# EAGLE design node (EAGLE 7.3.0)
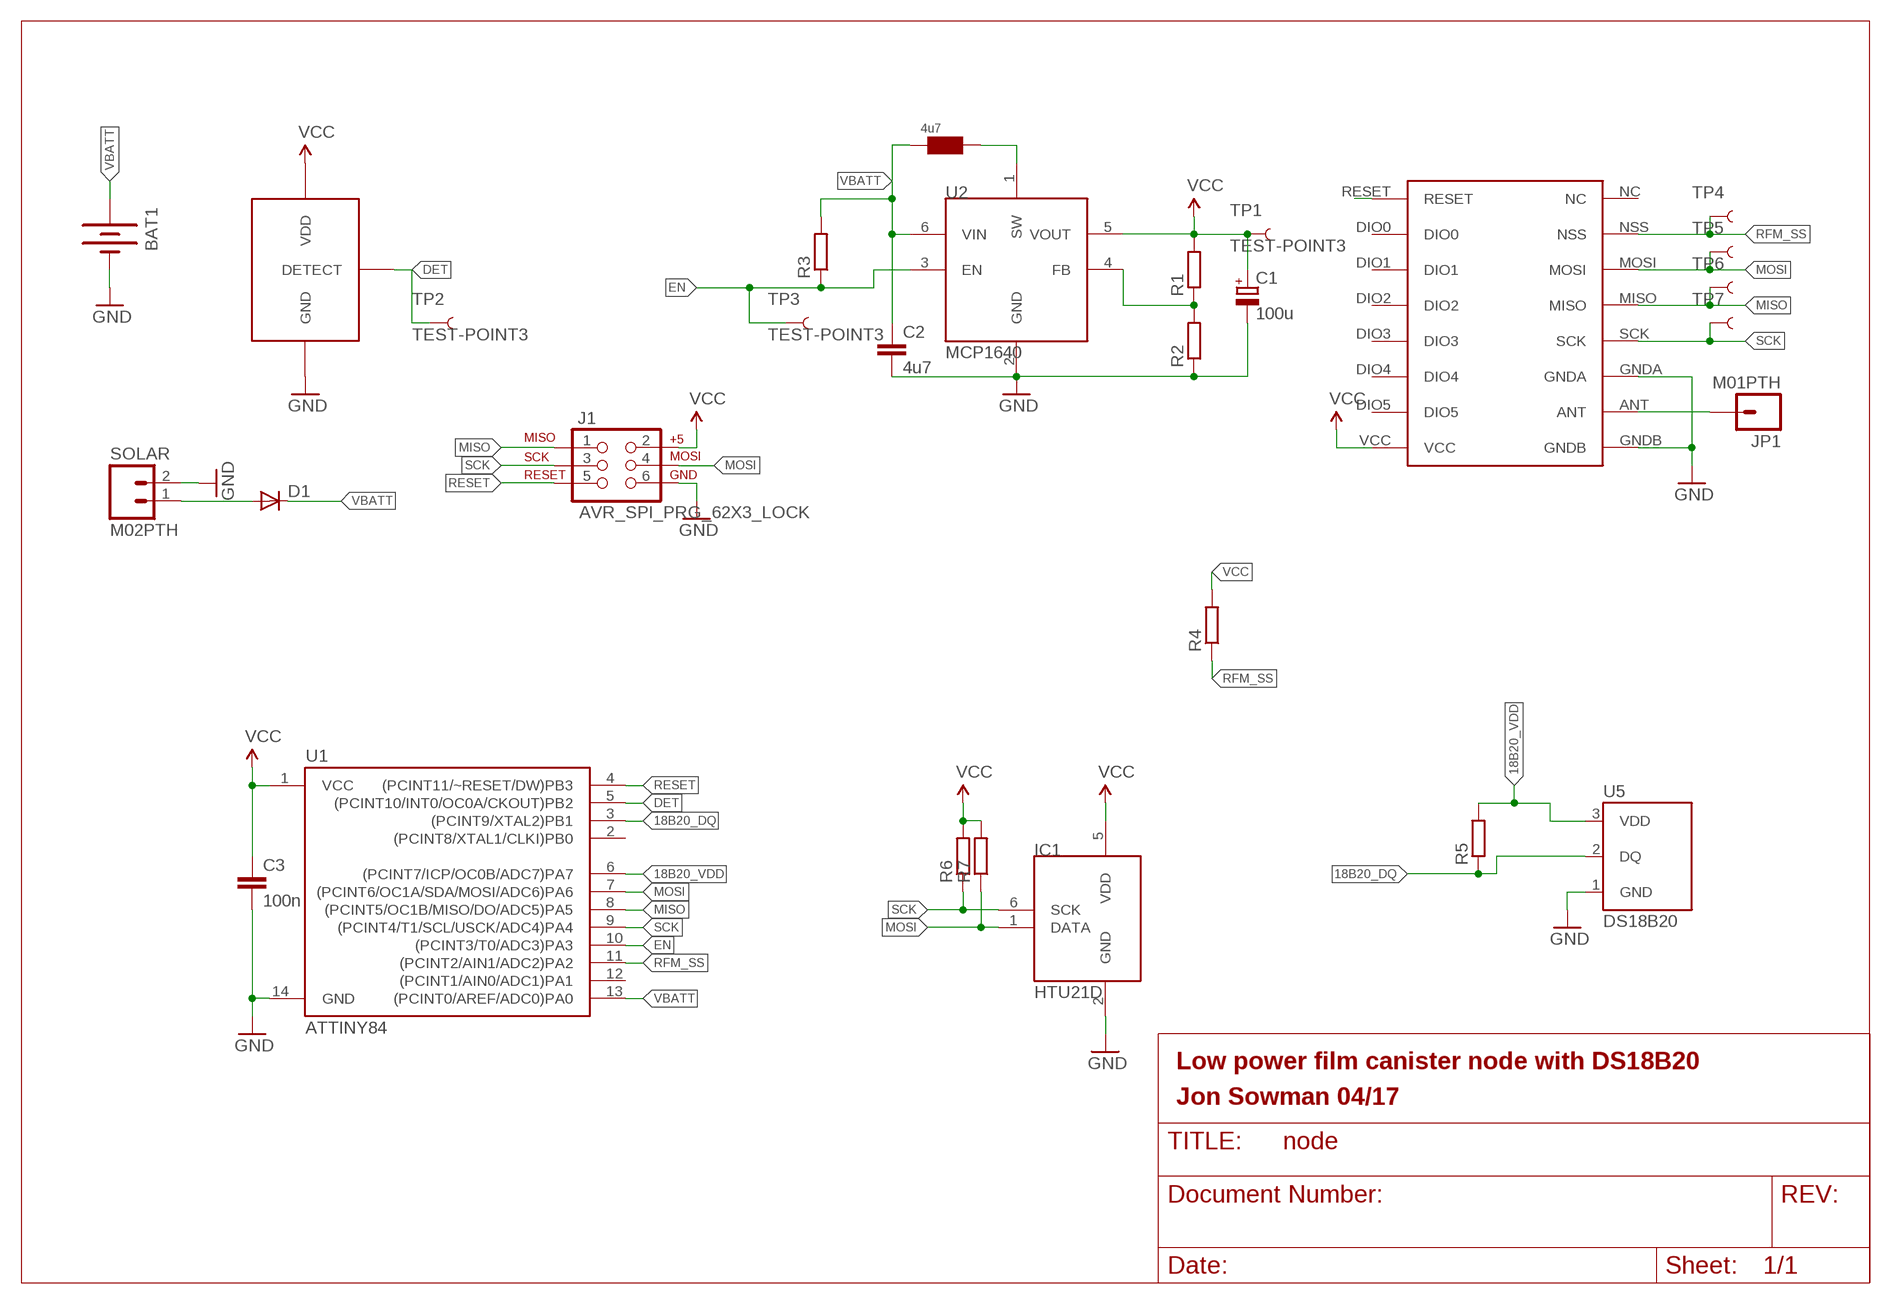
[diagram p0: schematic, sheet 1]

## Parts
BAT1  BATTERYAAA  [BATTERY-AAA]
C1  100u  CPOL-EUSANYO_SMD_C6  [SANYO-OSCON_SMD_C6]
C2  4u7  C-EUC0603  [C0603]
C3  100n  C-EUC0603  [C0603]
D1  DIODE-SOD123  [SOD123]
DF  4u7  BOURNS_SRN5040  [BOURNS_SRN5040_L]
IC1  HTU21D  [DFN6-L]
J1  AVR_SPI_PRG_62X3_LOCK  [2X3_LOCK]
JP1  M01PTH  [1X01]
R1  R-EU_R0603  [R0603]
R2  R-EU_R0603  [R0603]
R3  R-EU_R0603  [R0603]
R4  R-EU_R0603  [R0603]
R5  R-EU_R0603  [R0603]
R6  R-EU_R0603  [R0603]
R7  R-EU_R0603  [R0603]
SOLAR  M02PTH  [1X02]
TP1  TEST-POINT3  [PAD.03X.03]
TP2  TEST-POINT3  [PAD.03X.03]
TP3  TEST-POINT3  [PAD.03X.03]
TP4  TEST-POINT3  [PAD.03X.03]
TP5  TEST-POINT3  [PAD.03X.03]
TP6  TEST-POINT3  [PAD.03X.03]
TP7  TEST-POINT3  [PAD.03X.03]
U1  ATTINY84  [SO14]
U2  MCP1640  [SOT23-6]
U3  BU49X_VDET_SOT235  [SOT23-5L]
U5  DS18B20  [TO-92-AMMO]
U$4  RFM69HW  [RFM]

## Nets
18B20_DQ: R5.1 U1.3((PCINT9/XTAL2)PB1) U5.2(DQ)
18B20_VDD: R5.2 U1.6((PCINT7/ICP/OC0B/ADC7)PA7) U5.3(VDD)
DET: TP2.P$1 U1.5((PCINT10/INT0/OC0A/CKOUT)PB2) U3.1(DETECT)
EN: R3.1 TP3.P$1 U1.10((PCINT3/T0/ADC3)PA3) U2.3(EN)
GND: BAT1.GND@1(-) C1.- C2.2 C3.2 IC1.2(GND) J1.6 R2.1 SOLAR.2 U1.14(GND) U2.2(GND) U3.3(GND) U5.1(GND) U$4.GNDA U$4.GNDB
MISO: J1.1 TP6.P$1 U1.8((PCINT5/OC1B/MISO/DO/ADC5)PA5) U$4.MISO
MOSI: IC1.1(DATA) J1.4 R7.1 TP5.P$1 U1.7((PCINT6/OC1A/SDA/MOSI/ADC6)PA6) U$4.MOSI
N$1: DF.P$2 U2.1(SW)
N$2: R1.1 R2.2 U2.4(FB)
N$3: JP1.1 U$4.ANT
N$5: D1.A SOLAR.1
N$7: U$4.RESET
RESET: J1.5 U1.4((PCINT11/~RESET/DW)PB3)
RFM_SS: R4.1 TP4.P$1 U1.11((PCINT2/AIN1/ADC2)PA2) U$4.NSS
SCK: IC1.6(SCK) J1.3 R6.1 TP7.P$1 U1.9((PCINT4/T1/SCL/USCK/ADC4)PA4) U$4.SCK
VBATT: BAT1.PWR@1(+) C2.1 D1.C DF.P$1 R3.2 U1.13((PCINT0/AREF/ADC0)PA0) U2.6(VIN)
VCC: C1.+ C3.1 IC1.5(VDD) J1.2 R1.2 R4.2 R6.2 R7.2 TP1.P$1 U1.1(VCC) U2.5(VOUT) U3.2(VDD) U$4.VCC
Unconnected: U1.2((PCINT8/XTAL1/CLKI)PB0) U1.12((PCINT1/AIN0/ADC1)PA1) U$4.DIO0 U$4.DIO1 U$4.DIO2 U$4.DIO3 U$4.DIO4 U$4.DIO5 U$4.NC

## Notes on the sheet
- Low power film canister node with DS18B20
- Jon Sowman 04/17

## Library data of the parts
BAT1 = SparkFun-Electromechanical:BATTERY: Battery Holders Various common sizes : AA, AAA, 18650 (PRT-12895), 20mm coin cell and 12mm coin cell. 20MM_4LEGS, BATT-10373; PROD_ID: BATT-08571
C1 = rcl:CPOL-EU: POLARIZED CAPACITOR, European symbol
C2 C3 = rcl:C-EU: CAPACITOR, European symbol
D1 = dtb:DIODE-: DIODE
DF = jonsowman:BOURNS_SRN5040
IC1 = Mine:HTU21D
J1 = SparkFun-Connectors:AVR_SPI_PRG_6: AVR ISP 6 Pin This is the reduced ISP connector for AVR programming. Common on Arduino. This footprint will take up less PCB space and can be used with a 10-pin to 6-pin adapter such as SKU: BOB-08508 **Special note about "TEST_POINT" package. The stop mask is on the top side, so if you want your programming test points to be on the bottom of your board, make sure to place this package on the bottom side of the board. This also ensure that the orientation to program from the bottom side will be correct.
JP1 = SparkFun-Connectors:M01: Header 1 Standard 1-pin 0.1" header. Use with straight break away headers (SKU : PRT-00116), right angle break away headers (PRT-00553), swiss pins (PRT-00743), machine pins (PRT-00117), and female headers (PRT-00115).
R1-R7 = rcl:R-EU_: RESISTOR, European symbol
SOLAR = SparkFun-Connectors:M02: Standard 2-pin 0.1" header. Use with - straight break away headers ( PRT-00116) - right angle break away headers (PRT-00553) - swiss pins (PRT-00743) - machine pins (PRT-00117) - female headers (PRT-00115) Molex polarized connector foot print use with: PRT-08233 with associated crimp pins and housings. 2.54_SCREWTERM for use with PRT-10571. 3.5mm Screw Terminal footprints for PRT-08084 5mm Screw Terminal footprints for use with PRT-08432
TP1-TP7 = SparkFun-Passives:TEST-POINT: Bare copper test points for troubleshooting or ICT
U1 = SparkFun-DigitalIC:ATTINY84: Atmel 14-pin 2/4/8kB flash uC; PROD_ID: IC-11285
U2 = ukhas:MCP1640
U3 = jonsowman:BU49X_VDET_SOT235
U5 = SparkFun-Sensors:DS18B20: Dallas/Maxim DS18B20 1-wire temperature sensor Datasheet: http://datasheets.maximintegrated.com/en/ds/DS18B20.pdf temp thermometer 1-wire one-wire one wire; STORE_ID: SEN-00245
U$4 = hoperf:RFM69HW

## Board
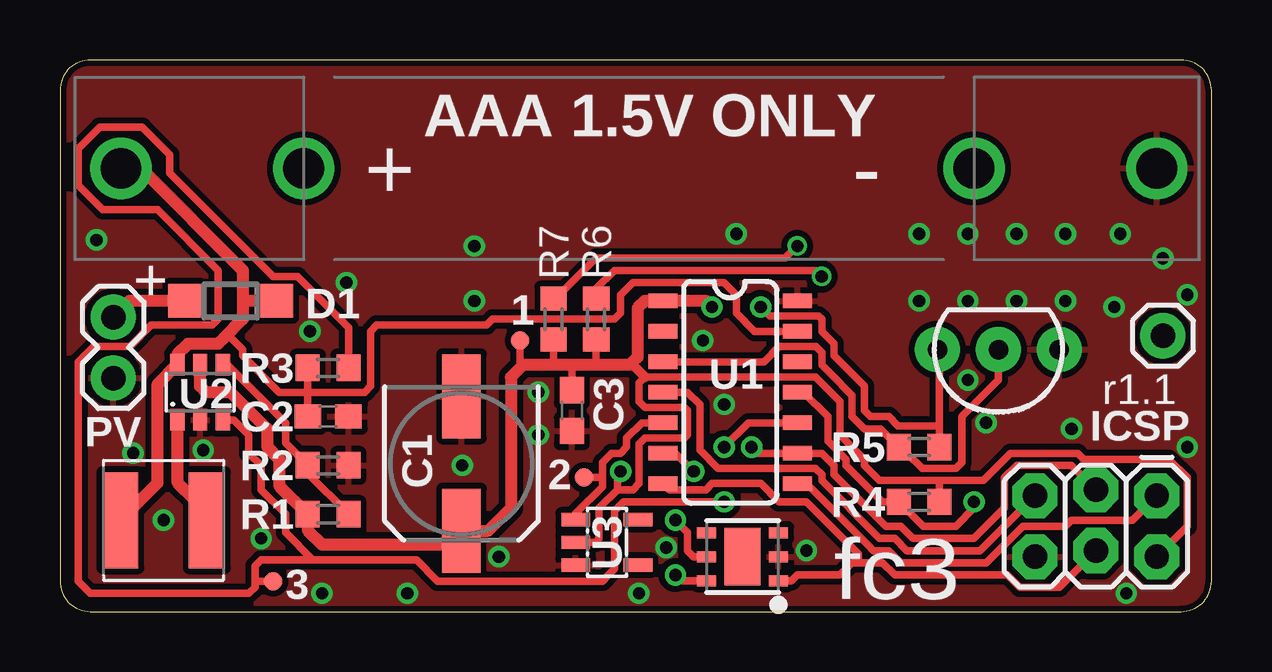
[diagram p1: board, top side]
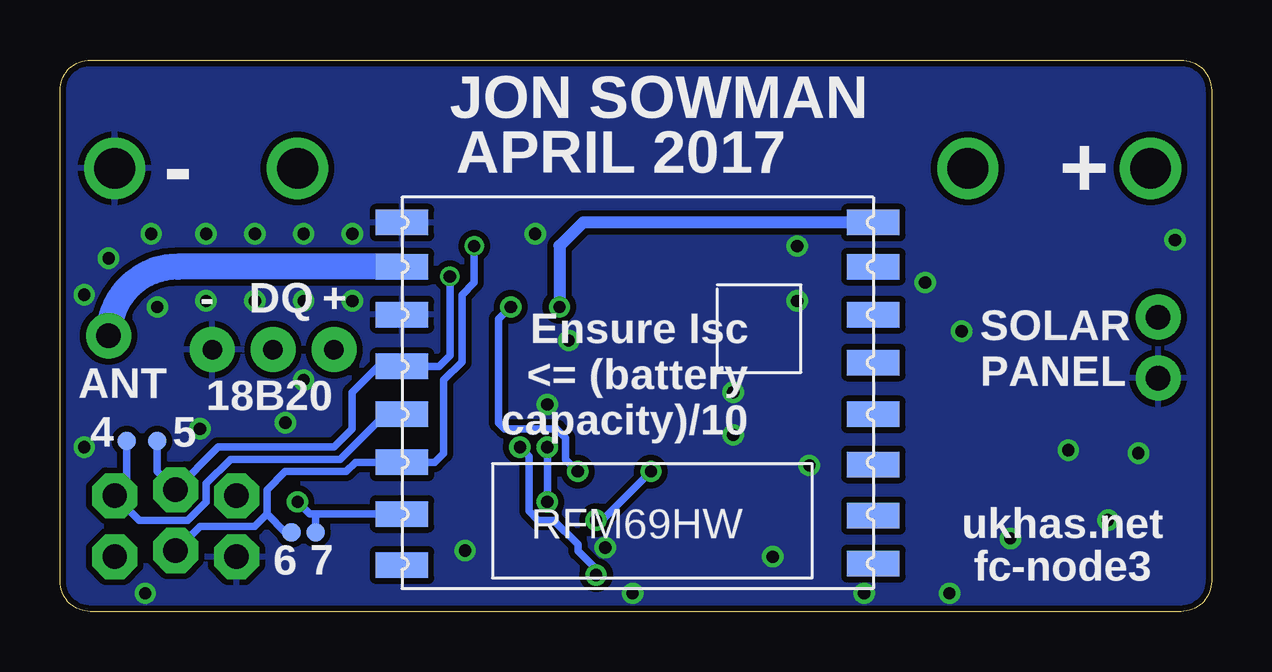
[diagram p2: board, bottom side, seen from below]

Size 48 x 23 mm. Coordinates in mm from the lower left corner, seen from the top.
Outline: 48,1.27 48,21.73 arc90 46.73,23 1.27,23 arc90 0,21.73 0,1.27 arc90 1.27,0 46.73,0 arc90 48,1.27
Copper layers (1*16): Top 0.035mm / dielectric 1.5mm / Bottom 0.035mm
Design rules "dirt_cheap_dirty_boards.v1": minimum track width 5mil, minimum drill 12mil, track to track 5mil, track to pad 5mil, pad to pad 5mil, via to via 5mil, smd to smd 0mil, copper to edge 10mil, drill to drill 10mil, minimum pad ring 10mil, minimum via ring 6mil, stop-mask expansion 2mil, vias tented up to drill 25mil, thermal gap 10mil

### Footprints (pad centres in the part's own frame; a part is rotated, then mirrored left to right if it is on the bottom)
BATTERY-AAA = drill 1.702: GND@1 21.59,0; GND@2 13.97,0; PWR@1 -21.59,0; PWR@2 -13.97,0
SANYO-OSCON_SMD_C6 = smd 3.5 x 1.6: + 2.8,0; - -2.8,0
C0603 = smd 1.1 x 1: 1 -0.85,0; 2 0.85,0
SOD123 = smd 1.4 x 1.4: A 1.9,0; C -1.9,0
BOURNS_SRN5040_L = smd 1.5 x 4: P$1 -1.8,0; P$2 1.8,0
DFN6-L = smd 0.45 x 0.8: 1 -1,-1.5; 2 0,-1.5; 3 1,-1.5; 4 1,1.5; 5 0,1.5; 6 -1,1.5 | smd 2.4 x 1.5: EP 0,0
2X3_LOCK = drill 1.016 pad 1.88 octagon: 1 0,0; 2 0,2.54; 3 2.54,-0.254; 4 2.54,2.286; 5 5.08,0; 6 5.08,2.54
1X01 = drill 1.016 pad 1.88: 1 0,0
R0603 = smd 1 x 1.1: 1 -0.85,0; 2 0.85,0
1X02 = drill 1.016 pad 1.88: 1 0,0; 2 2.54,0
PAD.03X.03 = smd 0.762 x 0.762: P$1 0,0
SO14 = smd 0.6 x 1.2: 1 -3.81,-2.8; 2 -2.54,-2.8; 3 -1.27,-2.8; 4 0,-2.8; 5 1.27,-2.8; 6 2.54,-2.8; 7 3.81,-2.8; 8 3.81,2.8; 9 2.54,2.8; 10 1.27,2.8; 11 0,2.8; 12 -1.27,2.8; 13 -2.54,2.8; 14 -3.81,2.8
SOT23-6 = smd 0.6 x 0.9: 1 -0.95,-1.15; 2 0,-1.15; 3 0.95,-1.15; 4 0.95,1.15; 5 0,1.15; 6 -0.95,1.15
SOT23-5L = smd 0.55 x 1.2: 1 -0.95,-1.3; 2 0,-1.3; 3 0.95,-1.3; 4 0.95,1.3; 5 -0.95,1.3
TO-92-AMMO = drill 0.813 pad 1.88: 1 -2.54,0; 2 0,0; 3 2.54,0
RFM = smd 2.184 x 1.067: ANT 19.651,2.889; DIO0 0,13.27; DIO1 0,11.143; DIO2 0,9.047; DIO3 0,6.889; DIO4 0,4.889; DIO5 0,2.889; GNDA 19.651,4.889; GNDB 19.651,1.048; MISO 19.651,9.047; MOSI 19.651,11.047; NC 19.651,15.334; NSS 19.651,13.206; RESET 0,15.27; SCK 19.651,7.048; VCC 0,1.048

### Placement (x,y rotation side)
BAT1  24.13,18.48 0 top
C1  16.73,6.17 270 top
C2  11.18,8.13 0 top
C3  21.34,8.38 270 top
D1  7.11,12.95 180 top
DF  4.32,3.81 0 top
IC1  28.45,2.29 90 top
J1  45.72,4.83 180 top
JP1  45.97,11.5 0 top
R1  11.18,4.06 180 top
R2  11.18,6.1 180 top
R3  11.18,10.16 180 top
R4  35.81,4.57 0 top
R5  35.81,6.86 0 top
R6  22.35,12.19 270 top
R7  20.57,12.19 270 top
SOLAR  2.22,12.27 270 top
TP1  19.18,11.3 0 top
TP2  21.84,5.59 0 top
TP3  8.89,1.27 0 top
TP4  37.34,3.3 0 bottom
TP5  38.35,3.3 0 bottom
TP6  45.21,7.11 0 bottom
TP7  43.94,7.11 0 bottom
U1  27.94,9.14 270 top
U2  5.84,9.14 0 top
U3  22.8,2.89 270 top
U5  39.12,10.92 180 top
U$4  14.1,17.27 180 bottom

### Tracks (layer width: path | path; a pad name or v marks a point on that pad's centre or on a via)
18B20_DQ
  Top 0.305: U1.3 29.34,10.41 29.97,11.05 31.51,11.05 31.75,10.8 31.75,10.28 32.13,9.91 33.02,9.02 33.02,8.13 33.53,7.62 34.2,7.62 R5.1 35.22,6.6 35.31,6.6 35.94,5.97 37.34,5.97 37.59,6.22 37.59,8.13 39.12,9.65 U5.2
18B20_VDD  (via drill 0.51 pad 0.89)
  Top 0.305: R5.2 36.66,7.75 | 36.66,7.75 36.66,10.83 U5.3 | U1.6 25.65,6.6 v26.42,5.84 | v29.21,12.7 29.59,12.32 31.62,12.32 31.75,12.19 31.75,11.68 32.26,11.18 32.26,10.67 33.53,9.4 33.53,8.38 33.78,8.13 34.54,8.13 34.92,7.75 36.66,7.75
  Bottom 0.305: v26.42,5.84 26.92,6.35 26.92,7.24 27.3,7.62 29.46,7.62 29.72,7.87 29.72,10.79 29.72,12.19 v29.21,12.7
DET
  Top 0.305: U3.1 21.5,4.1 22.61,5.21 22.61,5.59 | 22.61,5.59 22.61,6.22 22.99,6.6 23.37,6.6 23.62,6.86 23.62,7.24 24.26,7.87 U1.5 | TP2.P$1 22.61,5.59
EN  (via drill 0.51 pad 0.89)
  Top 0.305: U1.10 28.7,7.87 v27.69,6.86 | v27.69,4.57 25.65,4.57 23.5,4.57 23.11,4.19 23.11,1.78 22.86,1.52 22.61,1.27 15.75,1.27 14.86,2.16 10.54,2.16 | 10.54,2.16 8.38,2.16 8.13,1.91 8.13,1.27 | R3.1 12.03,11.85 9.91,13.97 8.89,13.97 4.57,18.29 4.57,19.05 3.43,20.19 1.65,20.19 0.76,19.3 0.76,17.78 1.78,16.76 4.06,16.76 6.6,14.22 6.6,13.84 6.6,12.19 6.35,11.94 3.81,11.94 2.92,11.05 1.4,11.05 0.76,10.41 0.76,5.33 | 0.76,5.84 0.76,5.33 | 0.76,5.33 0.76,1.27 1.27,0.76 7.11,0.76 7.87,0.76 8.13,1.02 8.13,1.27 | U2.3 7.25,7.99 7.87,7.37 7.87,6.6 8.38,6.1 8.38,5.08 9.4,4.06 9.4,3.3 10.54,2.16 | TP3.P$1 8.13,1.27
  Bottom 0.305: v27.69,6.86 v27.69,4.57
GND  (via drill 0.51 pad 0.89)
  other vias: 27.69,8.64 39.88,15.75 41.91,15.75 44.2,15.75 45.97,14.73 37.85,15.75 35.81,15.75 14.48,0.76 10.92,0.76 16.76,6.1 18.29,2.29 26.8,11.3 31.11,2.54 4.32,3.81 1.52,15.49 10.41,11.68 11.94,13.72 3.05,6.6 5.97,6.73 25.27,2.67 37.85,12.95 35.81,12.95 39.88,12.95 41.91,12.95 43.94,12.7 42.16,7.62 46.99,6.86 24.13,0.76 17.27,12.95 17.27,15.24 28.19,15.75 8.38,3.05 44.45,0.76 37.85,9.65 38.61,7.87 46.99,13.21 19.94,9.14 19.94,7.37
  pour Top (isolate 0.254): 0,23.11 47.89,23.11 47.89,0 0,0
  pour Bottom (isolate 0.254): 0,23.11 47.89,23.11 47.89,0 0,0
MISO
  Top 0.305: J1.1 44.7,3.81 42.16,3.81 41.91,3.56 40.13,3.56 38.61,2.03 35.05,2.03 34.54,2.54 33.91,2.54 33.66,2.79 31.11,5.33 U1.8
  Bottom 0.305: U$4.MISO 34.45,8.22 36.32,6.35 40.89,6.35 41.91,5.33 41.91,5.08 41.91,4.57 42.67,3.81 44.7,3.81 J1.1 45.21,5.33 TP6.P$1
MOSI  (via drill 0.51)
  Top 0.305: J1.4 41.66,1.02 40.01,1.02 39.5,1.52 34.8,1.52 34.29,2.03 33.27,2.03 | IC1.1 30.5,1.29 30.73,1.52 32.51,1.52 33.02,2.03 33.27,2.03 | U1.7 25.4,5.08 26.92,5.08 27.18,5.33 29.21,5.33 29.97,4.57 31.11,4.57 33.27,2.41 33.27,2.03 | R7.1 20.66,13.04 22.35,14.73 30.23,14.73 v30.73,15.24
  Bottom 0.305: U$4.MOSI 34.16,6.22 | U$4.MOSI 35.69,6.22 36.07,5.84 38.61,5.84 39.37,5.08 39.37,4.06 | 39.37,4.06 39.88,3.56 42.16,3.56 J1.4 | TP5.P$1 38.61,3.3 39.37,4.06 | U$4.MOSI 32.38,6.22 32,6.6 32,9.65 31.24,10.41 31.24,13.21 30.73,13.72 v30.73,15.24
N$1
  Top 0.508: U2.1 4.89,5.39 5.59,4.7 6.12,4.17 DF.P$2
N$2
  Top 0.305: U2.4 6.98,10.29 9.4,7.87 9.4,7.02 R2.2 10.33,5.76 R1.1
N$3
  Bottom 1.092: U$4.ANT 43.09,14.38 arc-90 JP1.1
N$5
  Top 0.508: SOLAR.1 2.65,12.7 2.9,12.95 D1.A
RESET
  Top 0.305: J1.5 40.39,4.57 38.61,2.79 38.35,2.54 35.31,2.54 34.8,3.05 34.16,3.05 34.04,3.17 31.75,5.46 31.75,5.71 31.5,5.97 27.43,5.97 26.67,6.73 26.67,8.64 26.16,9.14 U1.4
RFM_SS  (via drill 0.51 pad 0.89)
  Top 0.305: U1.11 30.99,9.14 32,8.13 32,7.11 32.77,6.35 32.77,6.1 34.04,4.83 34.29,4.57 | 34.29,4.57 34.54,4.57 | 34.54,4.57 R4.1 35.98,3.56 37.34,3.56 38.1,4.32 v38.1,4.57 | 34.54,4.57 34.29,4.57 | 34.29,4.57 34.54,4.57
  Bottom 0.305: U$4.NSS 37.34,4.07 | 37.34,4.07 37.59,4.07 v38.1,4.57 | TP4.P$1 37.34,4.06 37.34,4.07
SCK  (via drill 0.51, 0.51 pad 0.89)
  Top 0.305: J1.3 42.16,6.1 39.88,6.1 39.37,5.59 39.37,4.32 38.1,3.05 35.56,3.05 35.05,3.56 34.42,3.56 32.26,5.71 32.26,6.1 31.75,6.6 U1.9 29.08,6.6 v28.83,6.86 | IC1.6 25.89,1.29 v25.65,1.52 | R6.1 22.35,13.46 23.11,14.22 31.5,14.22 v31.75,13.97
  Bottom 0.305: v25.65,1.52 25.65,1.78 26.42,2.54 26.42,2.79 27.43,3.81 28.07,3.81 28.45,4.19 28.45,6.48 v28.83,6.86 | TP7.P$1 43.94,5.84 J1.3 41.4,6.86 36.58,6.86 35.81,7.62 35.81,9.14 34.73,10.22 U$4.SCK 32.19,10.22 31.75,10.67 v31.75,13.97
VBATT
  Top 0.305: 10.33,9.14 12.7,9.14 12.95,9.4 12.95,11.68 13.21,11.94 17.78,11.94 18.03,12.19 23.11,12.19 23.37,12.45 23.37,13.21 23.88,13.72 27.69,13.72 28.19,13.21 28.19,12.45 28.96,11.68 U1.13 | R3.2 10.33,9.14 | 10.33,9.14 C2.1 | 6.86,11.43 7.11,11.43 7.62,10.92 7.62,10.67 9.14,9.14 10.33,9.14
  Top 0.508: 8.89,12.95 D1.C 7.62,12.95 | DF.P$1 4.06,5.36 4.06,9.47 U2.6 4.89,10.73 5.33,11.18 6.6,11.18 6.86,11.43 7.62,12.19 7.62,12.95 | BAT1.PWR@1 3.36,18.48 7.62,14.22 7.62,12.95
VCC  (via drill 0.51 pad 0.89)
  Top 0.305: J1.2 46.99,3.56 46.99,5.59 46.23,6.35 42.67,6.35 42.42,6.6 39.62,6.6 38.48,5.46 36.58,5.46 | U3.2 22.32,2.89 22.48,3.05 22.48,4.32 23.24,5.08 | 23.24,5.08 23.88,5.08 24.13,5.33 24.13,6.99 24.38,7.24 26.04,7.24 26.16,7.37 26.16,8.38 26.04,8.51 24.38,8.51 24.13,8.76 24.13,9.53 24.38,9.78 31.5,9.78 32.51,8.76 32.51,7.37 33.53,6.35 33.53,6.1 34.16,5.46 36.58,5.46 | IC1.5 26.42,2.29 26.16,2.54 26.16,3.3 v25.65,3.81 | 23.24,5.08 23.24,5.71 v23.37,5.84 | R4.2 36.66,5.37 36.58,5.46 | R6.2 22.35,10.29 | C3.1 21.34,10.29 | R7.2 20.57,10.29 | TP1.P$1 19.18,10.41 19.3,10.29
  Top 0.406: 23.75,10.29 23.88,10.29 24.38,9.78
  Top 0.508: U2.5 5.84,9.4 6.1,9.14 7.11,9.14 8.64,7.62 8.64,6.86 9.14,6.35 9.14,5.25 R1.2 10.33,3.39 10.92,2.79 16.15,2.79 C1.+ 17.85,3.37 18.8,4.32 18.8,9.78 19.3,10.29 20.57,10.29 21.34,10.29 22.35,10.29 23.75,10.29 24.08,10.61 24.08,12.65 24.38,12.95 U1.1 26.92,12.95 v27.18,12.7
  Bottom 0.305: v25.65,3.81 25.4,3.81 v23.37,5.84
  Bottom 0.508: U$4.VCC 26.19,16.22 27.18,15.24 v27.18,12.7

### Text on the board
tPlace: AAA 1.5V ONLY | + | 1 | r1.1 | PV | ICSP | 2 | 3 | fc3
bPlace: JON SOWMAN | APRIL 2017 | + | - | Ensure Isc / <= (battery / capacity)/10 | + | DQ | - | SOLAR / PANEL | ANT | 18B20 | 5 | 4 | ukhas.net | 7 | 6 | fc-node3